# EAGLE design RascalDevShield (EAGLE 5.11)
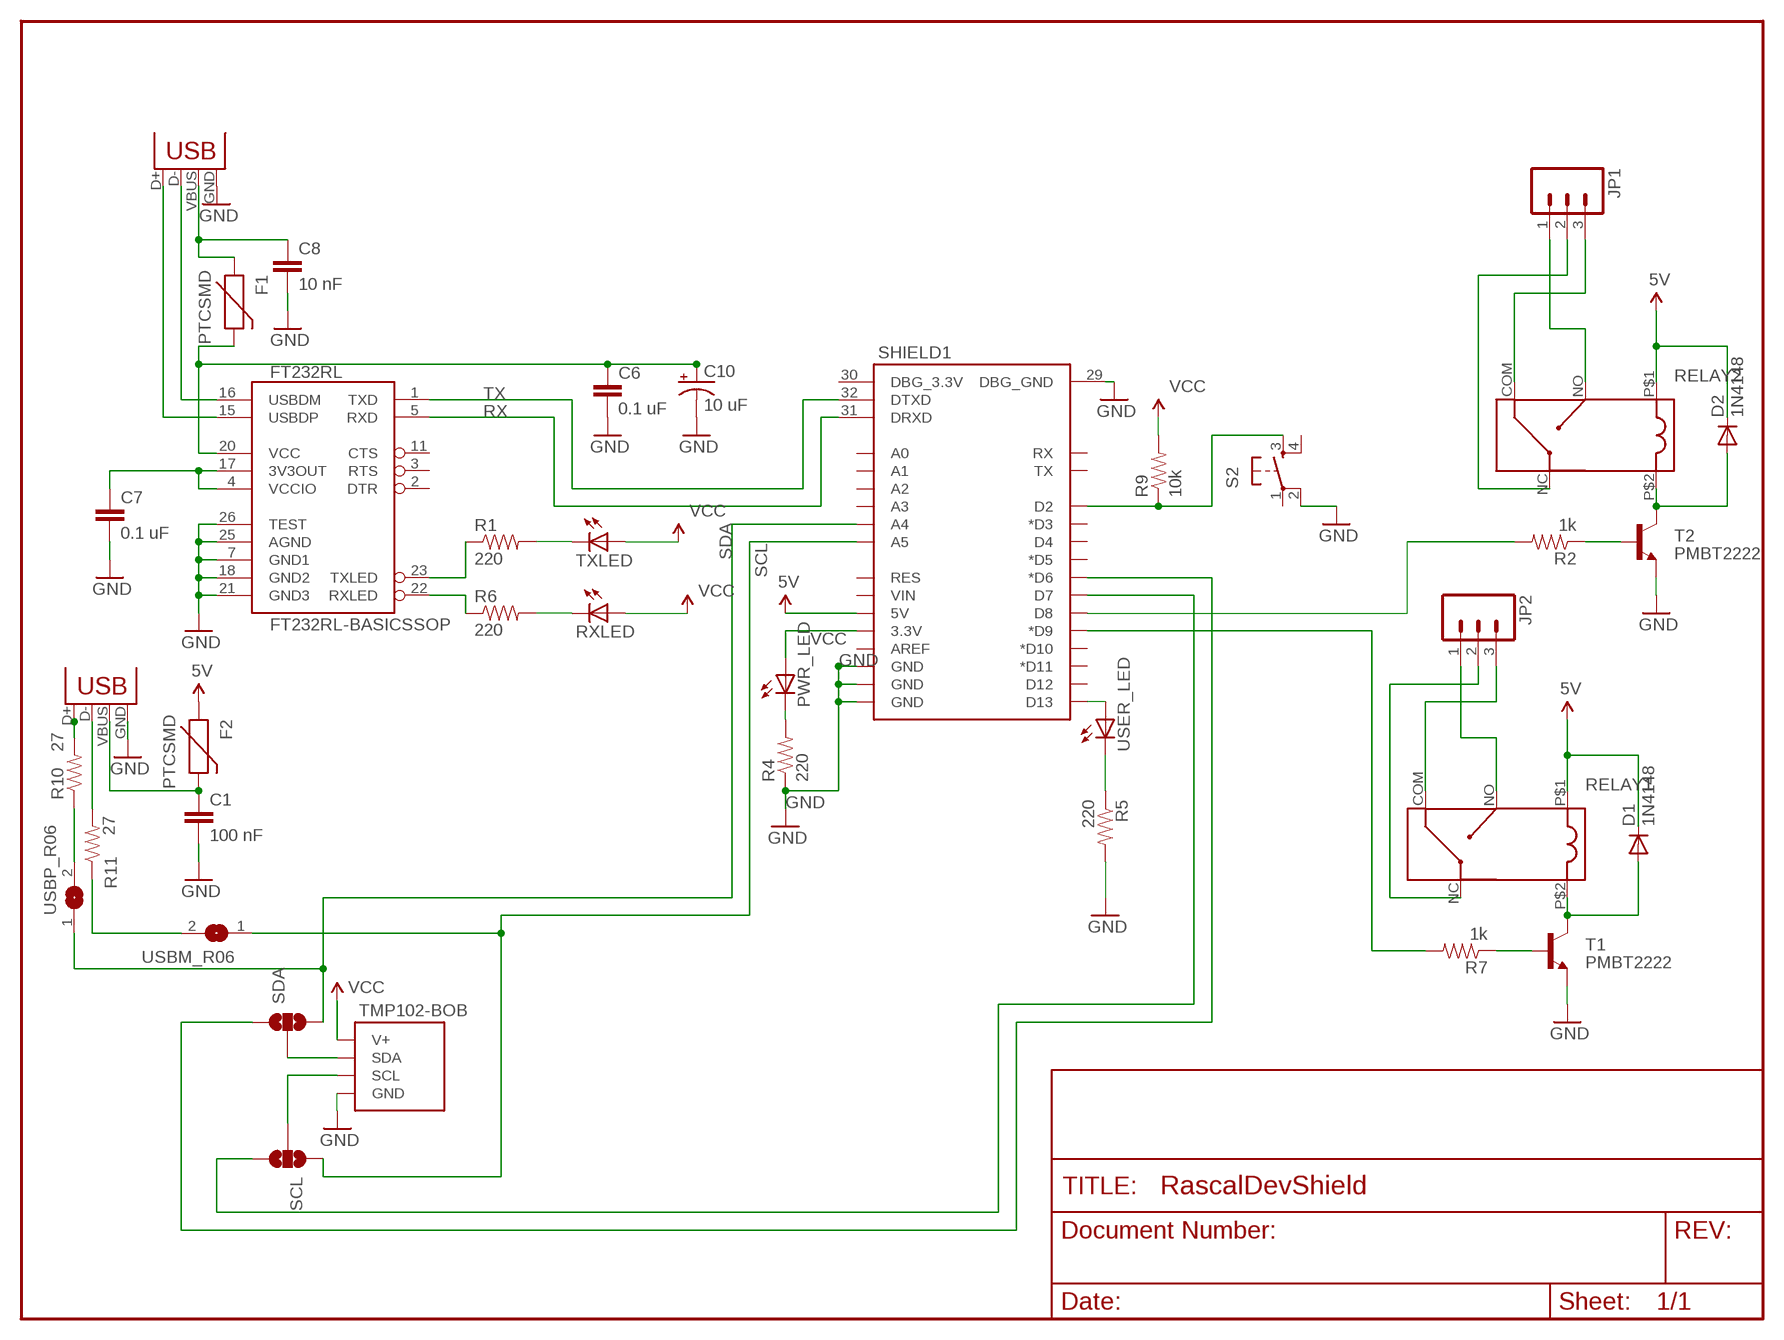
[diagram p0: schematic, sheet 1]

## Parts
C1  100 nF  CAP1206  [1206]
C6  0.1 uF  CAP1206  [1206]
C7  0.1 uF  CAP1206  [1206]
C8  10 nF  CAP1206  [1206]
C10  10 uF  CAP_POL1206  [EIA3216]
D1  1N4148  DIODE1N4148  [DIODE-1N4148]
D2  1N4148  DIODE1N4148  [DIODE-1N4148]
F1  PTCSMD  [PTC-1206]
F2  PTCSMD  [PTC-1206]
FT232RL  FT232RL-BASICSSOP  [SSOP28DB]
JP1  M03PTH  [1X03]
JP2  M03PTH  [1X03]
PWR_LED  LED1206  [LED-1206]
R1  220  RESISTOR1206  [1206]
R2  1k  RESISTOR1206  [1206]
R4  220  RESISTOR1206  [1206]
R5  220  RESISTOR1206  [1206]
R6  220  RESISTOR1206  [1206]
R7  1k  RESISTOR1206  [1206]
R9  10k  RESISTOR1206  [1206]
R10  27  RESISTOR1206  [1206]
R11  27  RESISTOR1206  [1206]
RELAY1  PCH-105D2H,000  [PCH-105D2H,000]
RELAY2  PCH-105D2H,000  [PCH-105D2H,000]
RXLED  LED1206  [LED-1206]
S2  TAC_SWITCHSMD  [TACTILE_SWITCH_SMD]
SCL  SOLDERJUMPER_2WAYT  [SJ_2]
SDA  SOLDERJUMPER_2WAYT  [SJ_2]
SHIELD1  RASCAL_SHIELD_DBG  [RASCAL_SHIELD_DBG]
T1  PMBT2222  [SOT-23]
T2  PMBT2222  [SOT-23]
TMP102-BOB  SPE_BO_TMP102_4PIN  [SPE_BO_TMP102_4PIN]
TXLED  LED1206  [LED-1206]
USBM_R06  SJ  [SJ]
USBP_R06  SJ  [SJ]
USER_LED  LED1206  [LED-1206]
X1  USBSMD  [USB-MINIB]
X2  USB-A-SMD  [USB-A-S-NOSILK-FEMALE]

## Nets
5V: D1.C D2.C F2.1 RELAY1.P$1 RELAY2.P$1 SHIELD1.26(5V)
33V_OUT: C7.1 FT232RL.4(VCCIO) FT232RL.17(3V3OUT)
GND: C1.2 C6.2 C7.2 C8.2 C10.C(-) FT232RL.7(GND1) FT232RL.18(GND2) FT232RL.21(GND3) FT232RL.25(AGND) FT232RL.26(TEST) R4.1 R5.2 S2.2 SHIELD1.15(GND) SHIELD1.24(GND) SHIELD1.25(GND) SHIELD1.29(DBG_GND) T1.2(E) T2.2(E) TMP102-BOB.GND X1.GND X2.GND
HOST_USBM: R11.1 USBM_R06.2
HOST_USBP: R10.2 X2.D+
N$1: R2.2 SHIELD1.9(D8)
N$2: R7.2 SHIELD1.10(*D9)
N$3: R9.1 S2.3 SHIELD1.3(D2)
N$4: R1.2 TXLED.C
N$5: R6.2 RXLED.C
N$6: PWR_LED.C R4.2
N$7: R5.1 USER_LED.C
N$8: SHIELD1.14(D13) USER_LED.A
N$10: R11.2 X2.D-
N$15: R10.1 USBP_R06.2
NPN_B: R7.1 T1.1(B)
NPN_B1: R2.1 T2.1(B)
NPN_C: D1.A RELAY1.P$2 T1.3(C)
NPN_C1: D2.A RELAY2.P$2 T2.3(C)
RELAY_COM: JP2.3 RELAY1.COM
RELAY_COM1: JP1.3 RELAY2.COM
RELAY_NC: JP2.2 RELAY1.NC
RELAY_NC1: JP1.2 RELAY2.NC
RELAY_NO: JP2.1 RELAY1.NO
RELAY_NO1: JP1.1 RELAY2.NO
RX: FT232RL.5(RXD) SHIELD1.31(DRXD)
RXLED: FT232RL.22(RXLED) R6.1
SCL: SCL.1 SHIELD1.17(A5) USBM_R06.1
SCL_RASCAL06: SCL.3 SHIELD1.8(D7)
SCL_TMP102: SCL.2 TMP102-BOB.SCL
SDA: SDA.3 SHIELD1.18(A4) USBP_R06.1
SDA_RASCAL06: SDA.1 SHIELD1.7(*D6)
SDA_TMP102: SDA.2 TMP102-BOB.SDA
TX: FT232RL.1(TXD) SHIELD1.32(DTXD)
TXLED: FT232RL.23(TXLED) R1.1
USB_VCC: C6.1 C10.A(+) F1.2 FT232RL.20(VCC)
USBDM: FT232RL.16(USBDM) X1.D-
USBDP: FT232RL.15(USBDP) X1.D+
VBUS: C8.1 F1.1 X1.VBUS
VBUS1: C1.1 F2.2 X2.VBUS
VCC: PWR_LED.A R9.2 RXLED.A SHIELD1.27(3.3V) TMP102-BOB.V+ TXLED.A
Unconnected: FT232RL.2(DTR) FT232RL.3(RTS) FT232RL.11(CTS) S2.1 S2.4 SHIELD1.1(RX) SHIELD1.2(TX) SHIELD1.4(*D3) SHIELD1.5(D4) SHIELD1.6(*D5) SHIELD1.11(*D10) SHIELD1.12(*D11) SHIELD1.13(D12) SHIELD1.16(AREF) SHIELD1.19(A3) SHIELD1.20(A2) SHIELD1.21(A1) SHIELD1.22(A0) SHIELD1.23(VIN) SHIELD1.28(RES) SHIELD1.30(DBG_3.3V)

## Library data of the parts
C1 C6-C8 = SparkFun:CAP: Capacitor Standard 0603 ceramic capacitor, and 0.1" leaded capacitor.
C10 = SparkFun:CAP_POL: Capacitor Polarized These are standard SMD and PTH capacitors. Normally 10uF, 47uF, and 100uF in electrolytic and tantalum varieties. Always verify the external diameter of the through hole cap, it varies with capacity, voltage, and manufacturer. The EIA devices should be standard.
D1 D2 = SparkFun:DIODE: Diode These are standard reverse protection diodes and small signal diodes. SMA package can handle up to about 1A. SOD-323 can handle about 200mA. What the SOD-323 package when ordering, there are some mfgs out there that are 5-pin packages.
F1 F2 = SparkFun:PTC: Resettable Fuse PTC Resettable Fuse. Spark Fun Electronics SKU : COM-08357
FT232RL = SparkFun:FT232RL-BASIC: USB UART This is the simplified version of the FT232RL unit. Only what you need, nothing you don't. Spark Fun Electronics SKU : COM-00650
JP1 JP2 = SparkFun:M03: Header 3 Standard 3-pin 0.1" header. Use with straight break away headers (SKU : PRT-00116), right angle break away headers (PRT-00553), swiss pins (PRT-00743), machine pins (PRT-00117), and female headers (PRT-00115). Molex polarized connector foot print use with SKU : PRT-08232 with associated crimp pins and housings.
PWR_LED RXLED TXLED USER_LED = SparkFun:LED: LEDs Standard schematic elements and footprints for 5mm, 3mm, 1206, and 0603 sized LEDs. 5mm - Spark Fun Electronics SKU : COM-00529 (and others)
R1 R2 R4-R7 R9-R11 = SparkFun:RESISTOR: Resistor Basic schematic elements and footprints for 0603, 1206, and PTH 1/10th watt (small) resistors.
RELAY1 RELAY2 = Rascal:PCH-105D2H,000
S2 = SparkFun:TAC_SWITCH: Momentary Switch Button commonly used for reset or general input. Spark Fun Electronics SKU : COM-00097
SCL SDA = SparkFun:SOLDERJUMPER_2WAY: Solder Jumper 2 way solder jumper
SHIELD1 = Rascal:RASCAL_SHIELD_DBG
T1 T2 = Rascal:PMBT2222: PMBT2222 NPN transistor (Digikey 568-1738-1-ND)
TMP102-BOB = Rascal:SPE_BO_TMP102_4PIN
USBM_R06 USBP_R06 = jumper:SJ: SMD solder JUMPER
X1 X2 = SparkFun:USB: USB Connectors USB-B-PTH is fully proven SKU : PRT-00139 USB-miniB is fully proven SKU : PRT-00587 USB-A-PCB is untested. USB-A-H is throughly reviewed, but untested. Spark Fun Electronics SKU : PRT-00437 USB-B-SMT is throughly reviewed, but untested. Needs silkscreen touching up. USB-A-S has not been used/tested USB-MB-H has not been used/tested

## Board
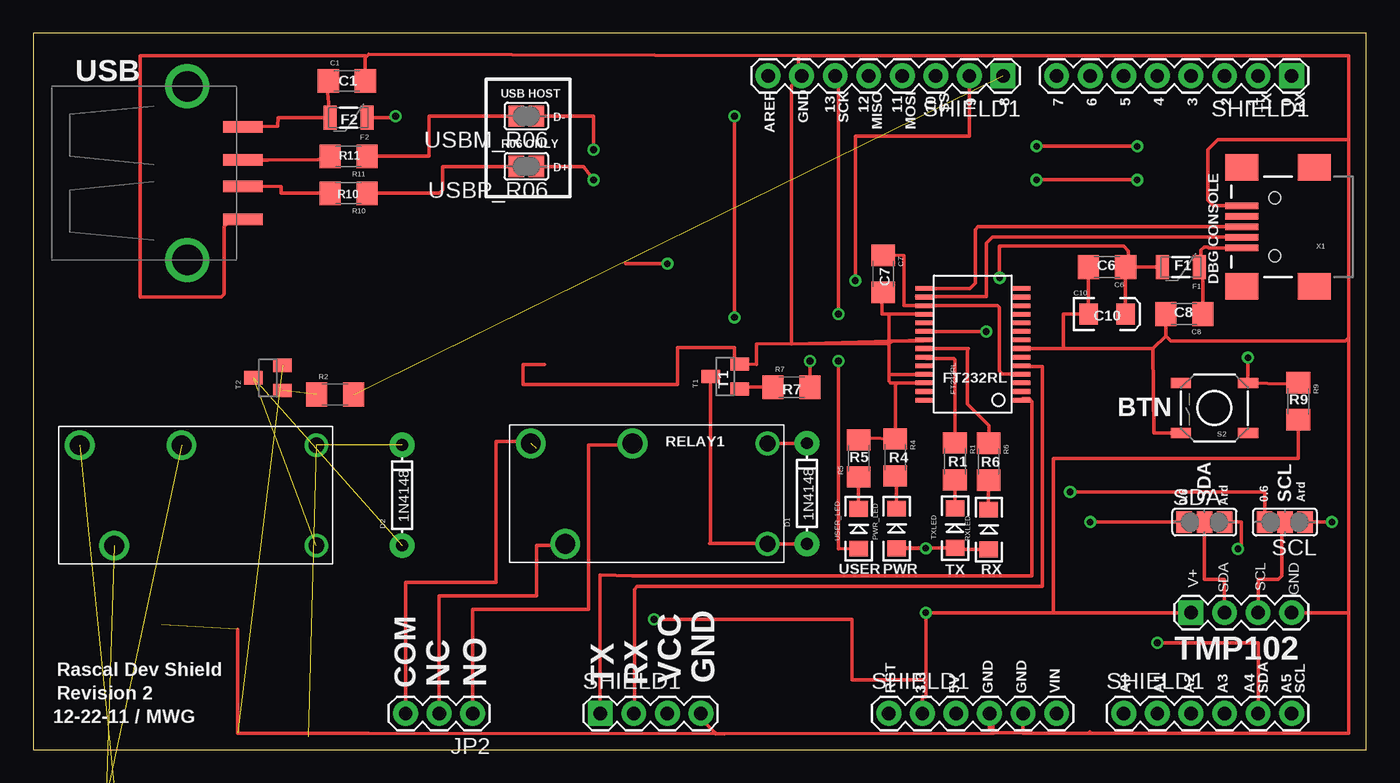
[diagram p1: board, top side]
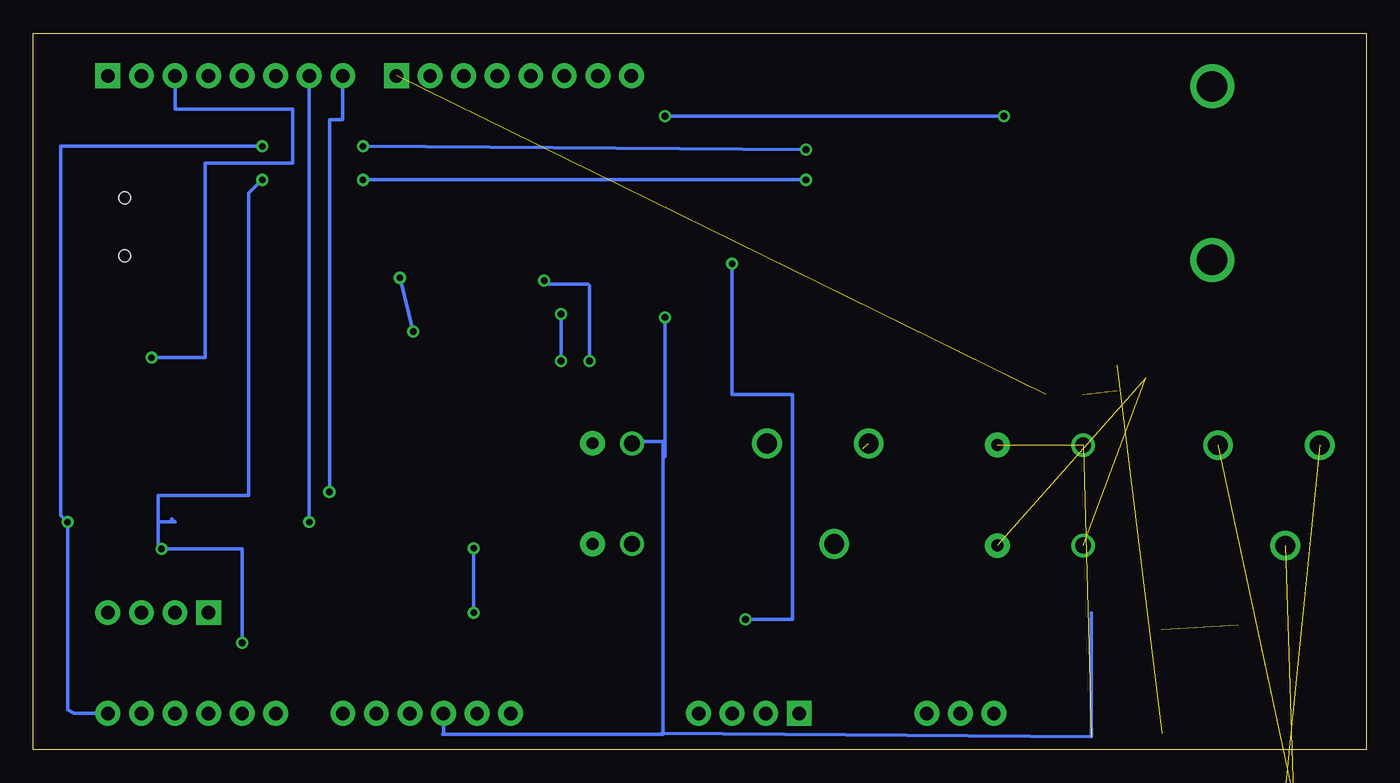
[diagram p2: board, bottom side, seen from below]

Size 100.91 x 54.24 mm. Coordinates in mm from the lower left corner, seen from the top.
Outline: 0,0 100.91,0 100.91,54.24 0,54.24 0,0
Copper layers (1*16): Top 0.035mm / dielectric 1.5mm / Bottom 0.035mm
Design rules "default *": minimum track width 5mil, minimum drill 12mil, track to track 5mil, track to pad 5mil, pad to pad 5mil, via to via 5mil, smd to smd 5mil, copper to edge 0mil, drill to drill 12mil, minimum pad ring 10mil, minimum via ring 8mil, stop-mask expansion 5mil, vias tented up to drill 0mil, thermal gap 10mil

### Footprints (pad centres in the part's own frame; a part is rotated, then mirrored left to right if it is on the bottom)
1206 = smd 1.6 x 1.8: 1 -1.4,0; 2 1.4,0
EIA3216 = smd 1.4 x 1.6: A 1.4,0; C -1.4,0
DIODE-1N4148 = drill 0.9 pad 1.88 round: A -3.81,0; C 3.81,0
PTC-1206 = smd 1 x 1.8: 1 -1.4,0; 2 1.4,0
SSOP28DB = smd 0.348 x 1.397: 1 -4.225,-3.656; 2 -3.575,-3.656; 3 -2.925,-3.656; 4 -2.275,-3.656; 5 -1.625,-3.656; 6 -0.975,-3.656; 7 -0.325,-3.656; 8 0.325,-3.656; 9 0.975,-3.656; 10 1.625,-3.656; 11 2.275,-3.656; 12 2.925,-3.656; 13 3.575,-3.656; 14 4.225,-3.656; 15 4.225,3.656; 16 3.575,3.656; 17 2.925,3.656; 18 2.275,3.656; 19 1.625,3.656; 20 0.975,3.656; 21 0.325,3.656; 22 -0.325,3.656; 23 -0.975,3.656; 24 -1.625,3.656; 25 -2.275,3.656; 26 -2.925,3.656; 27 -3.575,3.656; 28 -4.225,3.656
1X03 = drill 1.016 pad 1.88 round: 1 0,0; 2 2.54,0; 3 5.08,0
LED-1206 = smd 1.2 x 1.4: A -1.5,0; C 1.5,0
PCH-105D2H,000 = drill 1.5 round: COM 1,7.6; NC 3.6,0; NO 8.7,7.6 | drill 1.2 round: P$1 18.9,7.6; P$2 18.9,0
TACTILE_SWITCH_SMD = smd 1.524 x 0.762: 1 -2.54,1.905; 2 2.54,1.905; 3 -2.54,-1.905; 4 2.54,-1.905
SJ_2 = smd 1.168 x 1.6: 1 -1.524,0; 2 0,0; 3 1.524,0
RASCAL_SHIELD_DBG = drill 1.016 pad 1.88 square: 1 -5.08,50.8; 9 -26.924,50.8; 32 -57.404,2.54 | drill 1.016 pad 1.88 round: 2 -7.62,50.8; 3 -10.16,50.8; 4 -12.7,50.8; 5 -15.24,50.8; 6 -17.78,50.8; 7 -20.32,50.8; 8 -22.86,50.8; 10 -29.464,50.8; 11 -32.004,50.8; 12 -34.544,50.8; 13 -37.084,50.8; 14 -39.624,50.8; 15 -42.164,50.8; 16 -44.704,50.8; 17 -5.08,2.54; 18 -7.62,2.54; 19 -10.16,2.54; 20 -12.7,2.54; 21 -15.24,2.54; 22 -17.78,2.54; 23 -22.86,2.54; 24 -25.4,2.54; 25 -27.94,2.54; 26 -30.48,2.54; 27 -33.02,2.54; 28 -35.56,2.54; 29 -49.784,2.54; 30 -52.324,2.54; 31 -54.864,2.54
SOT-23 = smd 1 x 1.4: 1 -0.95,-1.1; 2 0.95,-1.1; 3 0,1.1
SPE_BO_TMP102_4PIN = drill 1.016 pad 1.88 round: GND 2.286,9.144; SCL 2.286,6.604; SDA 2.286,4.064 | drill 1.016 pad 1.88 square: V+ 2.286,1.524
SJ = smd 1.168 x 1.6: 1 -0.762,0; 2 0.762,0
USB-MINIB = smd 2.5 x 0.5: D+ 2.5,0; D- 2.5,0.8; GND 2.5,-1.6; ID 2.5,-0.8; VBUS 2.5,1.6 | smd 2.5 x 2: GND@1 -3,-4.5; GND@2 -3,4.5; GND@3 2.5,4.5; GND@4 2.5,-4.5 | hole 0.9: 0,2.2; 0,-2.2
USB-A-S-NOSILK-FEMALE = smd 3 x 0.9: D+ 4.212,-1; D- 4.212,1; GND 4.212,-3.5; VBUS 4.212,3.5 | drill 2.311 round: P$5 0,-6.566; P$6 0,6.566

### Placement (x,y rotation side)
C1  23.75,50.62 0 top
C6  81.28,36.53 180 top
C7  64.34,36.02 270 top
C8  87.12,32.97 180 top
C10  81.28,32.97 0 top
D1  58.57,19.38 90 top
D2  27.94,19.25 90 top
F1  86.87,36.53 180 top
F2  23.88,47.83 180 top
FT232RL  71.12,30.68 90 top
JP1  2.54,-17.58 0 top  (outside the outline)
JP2  33.27,2.74 180 top
PWR_LED  65.35,16.74 90 top
R1  69.77,21.82 270 top
R2  22.86,26.87 0 top
R4  65.25,22.12 270 top
R5  62.48,22.05 90 top
R6  72.31,21.79 270 top
R7  57.4,27.43 0 top
R9  95.76,26.37 270 top
R10  23.88,42.11 180 top
R11  23.88,44.91 180 top
RELAY1  36.68,15.57 0 top
RELAY2  2.54,15.44 0 top
RXLED  72.34,16.66 90 top
S2  89.41,25.86 180 top
SCL  94.74,17.22 180 top
SDA  88.65,17.22 0 top
SHIELD1  100.33,0.2 0 top
T1  52.37,28.24 90 top
T2  17.78,28.14 90 top
TMP102-BOB  86.11,12.65 270 top
TXLED  69.77,16.76 90 top
USBM_R06  37.34,47.96 180 top
USBP_R06  37.34,44.15 180 top
USER_LED  62.48,16.71 90 top
X1  93.98,39.57 180 top
X2  11.68,43.64 0 top

### Tracks (layer width: path | path; a pad name or v marks a point on that pad's centre or on a via)
5V  (via drill 0.51)  (2 unrouted)
  Top 0.254: RELAY1.P$1 D1.C | F2.1 27.3,47.83 v27.43,47.96 | v53.09,32.72 v53.09,47.96
  Bottom 0.254: SHIELD1.26 69.85,1.22 69.9,1.17 53.24,1.17 53.24,1.32 | 53.24,22.05 53.24,23.32 55.43,23.32 RELAY1.P$1 | v53.09,47.96 v27.43,47.96 | v53.09,32.72 53.09,22.2 53.24,22.05 | 53.24,1.32 53.24,22.05 | 53.24,1.32 53.34,1.22 20.83,0.97 20.83,10.36
33V_OUT
  Top 0.254: FT232RL.4 74.76,28.42 73.36,28.42 73.13,28.65 73.13,33.48 73,33.61 FT232RL.17 65.91,33.6 65.91,37.41 C7.1
GND  (2 unrouted)
  Top 0.254: 99.57,46.18 99.57,52.53 57.91,52.53 | 99.57,46.18 99.57,31.19 | 57.91,52.53 57.91,51.26 SHIELD1.15 57.4,50.24 57.4,30.68 FT232RL.21 67.39,30.94 65.02,30.94 | 85.72,31.32 C8.2 | 85.72,31.32 86.11,30.94 99.31,30.94 99.57,31.19 | X1.GND 89.33,41.17 88.9,41.61 88.9,45.42 89.66,46.18 99.57,46.18 | 77.98,30.36 FT232RL.7 | 84.76,30.36 77.98,30.36 | 85.72,31.32 84.76,30.36 | 77.98,30.36 77.98,32.97 C10.C C6.2 | 64.78,32.96 FT232RL.18 64.77,32.97 | 64.77,32.97 64.78,32.96 | 64.77,32.97 64.77,30.94 65.02,30.94 | 65.43,27.76 64.9,27.76 64.77,27.89 64.77,28.4 | 65.43,27.76 FT232RL.26 | 64.77,28.4 64.77,30.68 65.02,30.94 | 64.77,28.4 FT232RL.25 | 74.93,1.22 SHIELD1.24 | 80.11,1.22 74.93,1.22 | 80.11,1.22 99.57,1.22 99.57,10.36 | 64.78,32.96 64.78,30.8 64.72,30.73 54.74,30.68 54.74,29.16 T1.2 53.09,29.58 53.09,30.43 48.77,30.43 48.77,27.64 37.08,27.64 37.08,29.16 38.71,29.16 | SHIELD1.29 50.55,2.34 51.61,1.27 51.64,1.27 51.64,1.19 52.32,1.19 | 52.32,1.19 72.67,1.22 72.64,1.78 72.59,2.54 SHIELD1.25 72.39,1.6 72.72,1.27 74.88,1.27 74.93,1.22 | 80.11,1.22 79.98,1.35 | 65.43,27.76 65.25,27.58 R4.1 63.12,23.57 R5.2 | 99.57,31.19 99.57,10.36 | 99.57,10.36 TMP102-BOB.GND | S2.2 84.84,23.95 84.76,30.36 | C7.2 64.26,34.24 64.26,32.97 64.77,32.97 | 25.4,52.63 57.91,52.53 | 25.4,52.63 25.4,52.65 | 52.32,1.19 25.4,1.22 15.49,1.22 15.49,9.09 | 25.15,52.38 25.4,52.63 | 25.15,52.38 C1.2 | 25.15,52.38 25.15,52.52 25.15,52.53 8.13,52.53 8.13,34.24 14.22,34.24 14.48,34.49 14.48,39.57 14.99,40.08 15.84,40.08 X2.GND
HOST_USBM
  Top 0.254: R11.1 29.97,44.91 29.97,47.96 USBM_R06.2
HOST_USBP
  Top 0.254: X2.D+ 18.8,42.62 18.78,42.13 19.29,42.13 21.59,42.11 R10.2
N$1  (1 unrouted)
N$2  (via drill 0.51)
  Top 0.254: R7.2 v58.8,29.41 | v62.23,35.51 62.23,46.43 70.87,46.43 SHIELD1.10
  Bottom 0.254: v58.8,29.41 58.8,29.16 58.8,35.13 58.93,35.26 61.98,35.26 v62.23,35.51
N$3  (via drill 0.51)
  Top 0.254: R9.1 95.5,27.64 96.52,27.64 S2.3 v91.95,29.67
  Bottom 0.254: SHIELD1.3 90.17,48.46 81.28,48.46 81.28,44.4 87.88,44.4 87.88,29.67 v91.95,29.67
N$4
  Top 0.254: TXLED.C R1.2
N$5
  Top 0.254: R6.2 72.31,18.19 RXLED.C
N$6
  Top 0.254: PWR_LED.C 65.35,20.5 R4.2
N$7
  Top 0.254: USER_LED.C R5.1
N$8  (via drill 0.51)
  Top 0.254: USER_LED.A 60.96,15.19 v60.96,29.41 | v60.96,32.97 60.96,50.75 SHIELD1.14
  Bottom 0.254: v60.96,29.41 v60.96,32.97
N$10
  Top 0.254: X2.D- 17.8,44.64 21.59,44.65 R11.2
N$15
  Top 0.254: R10.1 30.73,42.11 30.99,42.37 30.99,44.15 USBP_R06.2
NPN_B
  Top 0.254: R7.1 53.61,27.43 T1.1
NPN_B1  (1 unrouted)
NPN_C
  Top 0.254: D1.A RELAY1.P$2 55.55,15.6 51.21,15.6 51.27,15.66 T1.3
NPN_C1  (2 unrouted)
RELAY_COM  (1 unrouted)
  Top 0.254: JP2.3 28.19,12.65 35.05,12.65 35.05,23.32 38.1,23.32 38.1,22.81
RELAY_COM1  (1 unrouted)
RELAY_NC
  Top 0.254: JP2.2 30.73,11.63 38.1,11.63 38.1,15.44 40.28,15.44 RELAY1.NC
RELAY_NC1  (1 unrouted)
RELAY_NO
  Top 0.254: JP2.1 33.27,10.62 42.04,10.62 42.04,23.06 45.38,23.06 RELAY1.NO
RELAY_NO1  (1 unrouted)
RX
  Top 0.254: SHIELD1.31 45.52,2.79 45.51,12.14 45.72,12.34 76.4,12.34 76.4,29.01 74.83,29.01 FT232RL.5
RXLED
  Top 0.254: FT232RL.22 70.78,30.36 70.71,30.23 70.71,26.16 72.34,24.54 72.34,23.22 R6.1
SCL  (via drill 0.51)
  Top 0.254: v98.3,17.22 SCL.1 | USBM_R06.1 42.42,47.96 v42.42,45.42 | v75.95,45.67 v83.57,45.67
  Bottom 0.254: SHIELD1.17 97.79,2.74 98.3,3 v98.3,17.22 98.81,17.73 98.81,45.67 v83.57,45.67 | v42.42,45.42 v75.95,45.67
SCL_RASCAL06  (via drill 0.51)
  Top 0.254: v78.49,19.51 93.22,19.51 SCL.3
  Bottom 0.254: SHIELD1.8 77.47,47.7 78.49,47.7 v78.49,19.51
SCL_TMP102
  Top 0.254: TMP102-BOB.SCL 92.71,12.9 94.23,12.9 94.49,13.16 94.49,16.97 SCL.2
SDA  (via drill 0.51)
  Top 0.254: SDA.3 91.44,17.22 91.44,15.44 v91.19,15.19 | v85.09,8.08 92.71,8.08 SHIELD1.18 | USBP_R06.1 41.66,44.15 v42.42,43.13 | v75.95,43.13 v83.57,43.13
  Bottom 0.254: v85.09,8.08 85.09,15.19 v91.19,15.19 91.44,15.44 91.44,17.22 | v42.42,43.13 v75.95,43.13 | v83.57,43.13 84.58,42.11 84.58,19.25 91.44,19.25 91.44,17.22 | SDA.3 90.42,17.48 | SDA.3 90.42,17.22 | 91.44,17.22 SDA.3
SDA_RASCAL06  (via drill 0.51)
  Top 0.254: v80.01,17.22 SDA.1
  Bottom 0.254: v80.01,17.22 SHIELD1.7
SDA_TMP102
  Top 0.254: TMP102-BOB.SDA 90.17,12.9 88.65,12.9 SDA.2
TX
  Top 0.254: SHIELD1.32 42.93,13.21 45.31,13.16 75.59,13.16 75.59,26.37 75.39,26.57 74.89,26.57 FT232RL.1
TXLED
  Top 0.254: R1.1 69.77,29.54 69.7,29.62 67.56,29.62 FT232RL.23
USB_VCC  (via drill 0.51)
  Top 0.254: C6.1 F1.2 | C6.1 C10.A | FT232RL.20 71.74,31.66 v72.14,31.65 | v73.15,35.71 73.15,38.1 82.55,38.1 82.91,37.74 82.91,36.75 C6.1
  Bottom 0.254: v72.14,31.65 v73.15,35.71
USBDM
  Top 0.254: X1.D- 91.44,38.81 72.59,38.81 72.14,38.35 72.14,34.29 67.43,34.29 | 67.43,34.29 66.85,34.29 | FT232RL.16 67.43,34.29
USBDP
  Top 0.254: X1.D+ 71.53,39.57 71.32,39.37 71.32,35.31 70.92,34.9 67.47,34.9 FT232RL.15
VBUS
  Top 0.254: X1.VBUS 88.98,37.97 88.9,38.05 88.65,38.05 88.39,37.8 88.39,36.65 F1.1 88.52,36.27 C8.1
VBUS1
  Top 0.254: X2.VBUS 18.51,47.19 18.54,47.83 F2.2 22.22,50.5 C1.1
VCC  (via drill 0.51)
  Top 0.254: 67.41,2.85 SHIELD1.27 67.31,4.01 67.56,4.01 67.56,5.28 | RXLED.A 69.77,15.16 TXLED.A 65.35,15.26 PWR_LED.A v67.56,15.24 | 67.56,5.28 v67.56,10.36 77.22,10.36 | 77.22,10.36 TMP102-BOB.V+ | R9.2 95.76,22.05 77.22,22.05 77.22,10.36 | 67.56,5.28 62,5.28 61.98,5.28 61.98,9.86 v46.99,9.86 | v48.01,36.78 44.86,36.78
  Bottom 0.254: v67.56,10.36 v67.56,15.24 | v46.99,9.86 43.43,9.86 43.43,26.87 48.01,26.87 v48.01,36.78

### Text on the board
tPlace: USB | C1 | USB HOST | 9 | 8 | 7 | 6 | 5 | 4 | 3 | 2 | 1 | 0 | D- | GND | 13 | SCK | 12 | 11 | 10 | SS | TX | RX | F2 | AREF | MISO | MOSI | R06 ONLY | R11 | D+ | DBG CONSOLE | R10 | C7 | C6 | F1 | C10 | C8 | T1 | FT232RL | R7 | R9 | BTN | RELAY1 | R5 | R4 | R1 | R6 | 0.6 | SDA | Ard | 0.6 | SCL | Ard | USER | PWR | TX | RX | TX | RX | TMP102 | Rascal Dev Shield | COM | NC | NO | VCC | GND | Revision 2 | RST | 3.3 | 5V | GND | GND | VIN | A0 | A1 | A2 | A3 | A4 | SDA | A5 | SCL | 12-22-11 / MWG